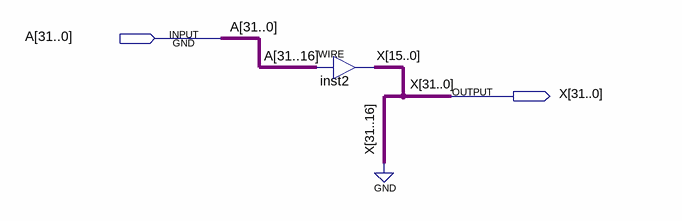
[diagram p0: schematic sheet]
// Quartus schematic shft16r32.bdf as structural Verilog: 1 symbols, 2 pins
module shft16r32 (
  input  [31:0] A,
  output [31:0] X
);

  assign X[15:0] = A[31:16];  // WIRE inst2

  assign X[31:16] = {16{1'b0}};
endmodule
